# Altium schematic sheet Sheet1.SchDoc
size A4
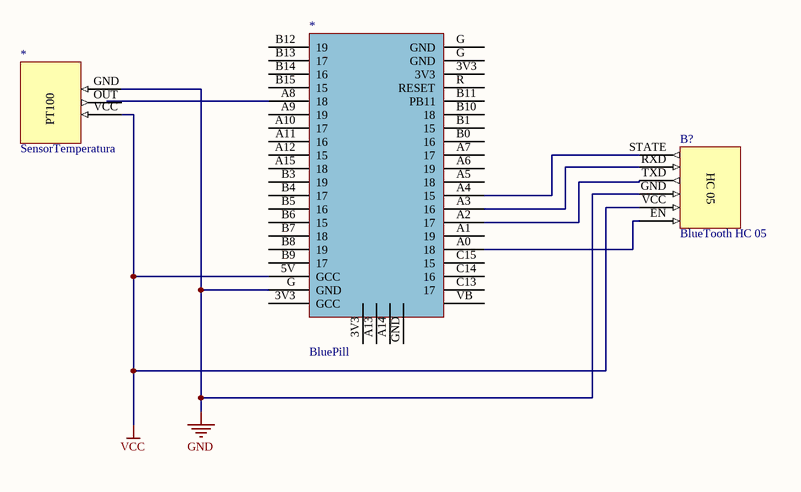
[diagram p0: Sheet1.SchDoc]

## Parts
(Parts that share a designator on the sheet are numbered #1, #2 ... from top to bottom, then left to right.)
*#1  BluePill
*#2  SensorTemperatura
B?  BlueTooth HC 05

## Nets
GND: *#1.G(GND) *#2.GND B?.GND
VCC: *#1.5V(GCC) *#2.VCC B?.VCC
Net*#1_A0: *#1.A0(18) B?.EN
Net*#1_A2: *#1.A2(17) B?.TXD
Net*#1_A3: *#1.A3(16) B?.RXD
Net*#1_A4: *#1.A4(15) B?.STATE

Not connected (* = marked no-connect by the designer): *#1 3V3(GCC) A1(19) A5(18) A6(19) A7(17) A8(18) A9(19) A10(17) A11(16) A12(15) A13(VB) A14(VB) A15(18) B0(16) B1(15) B3(19) B4(17) B5(16) B6(15) B7(18) B8(19) B9(17) B10(18) B11(PB11) B12(19) B13(17) B14(16) B15(15) C13(17) C14(16) C15(15) GND(VB) R(RESET) VB(VBAT); *#2 OUT(PWM)

## Notes on the sheet
- (in symbol BlueTooth) HC 05
- (in symbol SensorTemperatura) PT100

## Library data of the parts
B? = BlueTooth